# EAGLE schematic schematic_for_box_v13 (EAGLE 9.7.0)
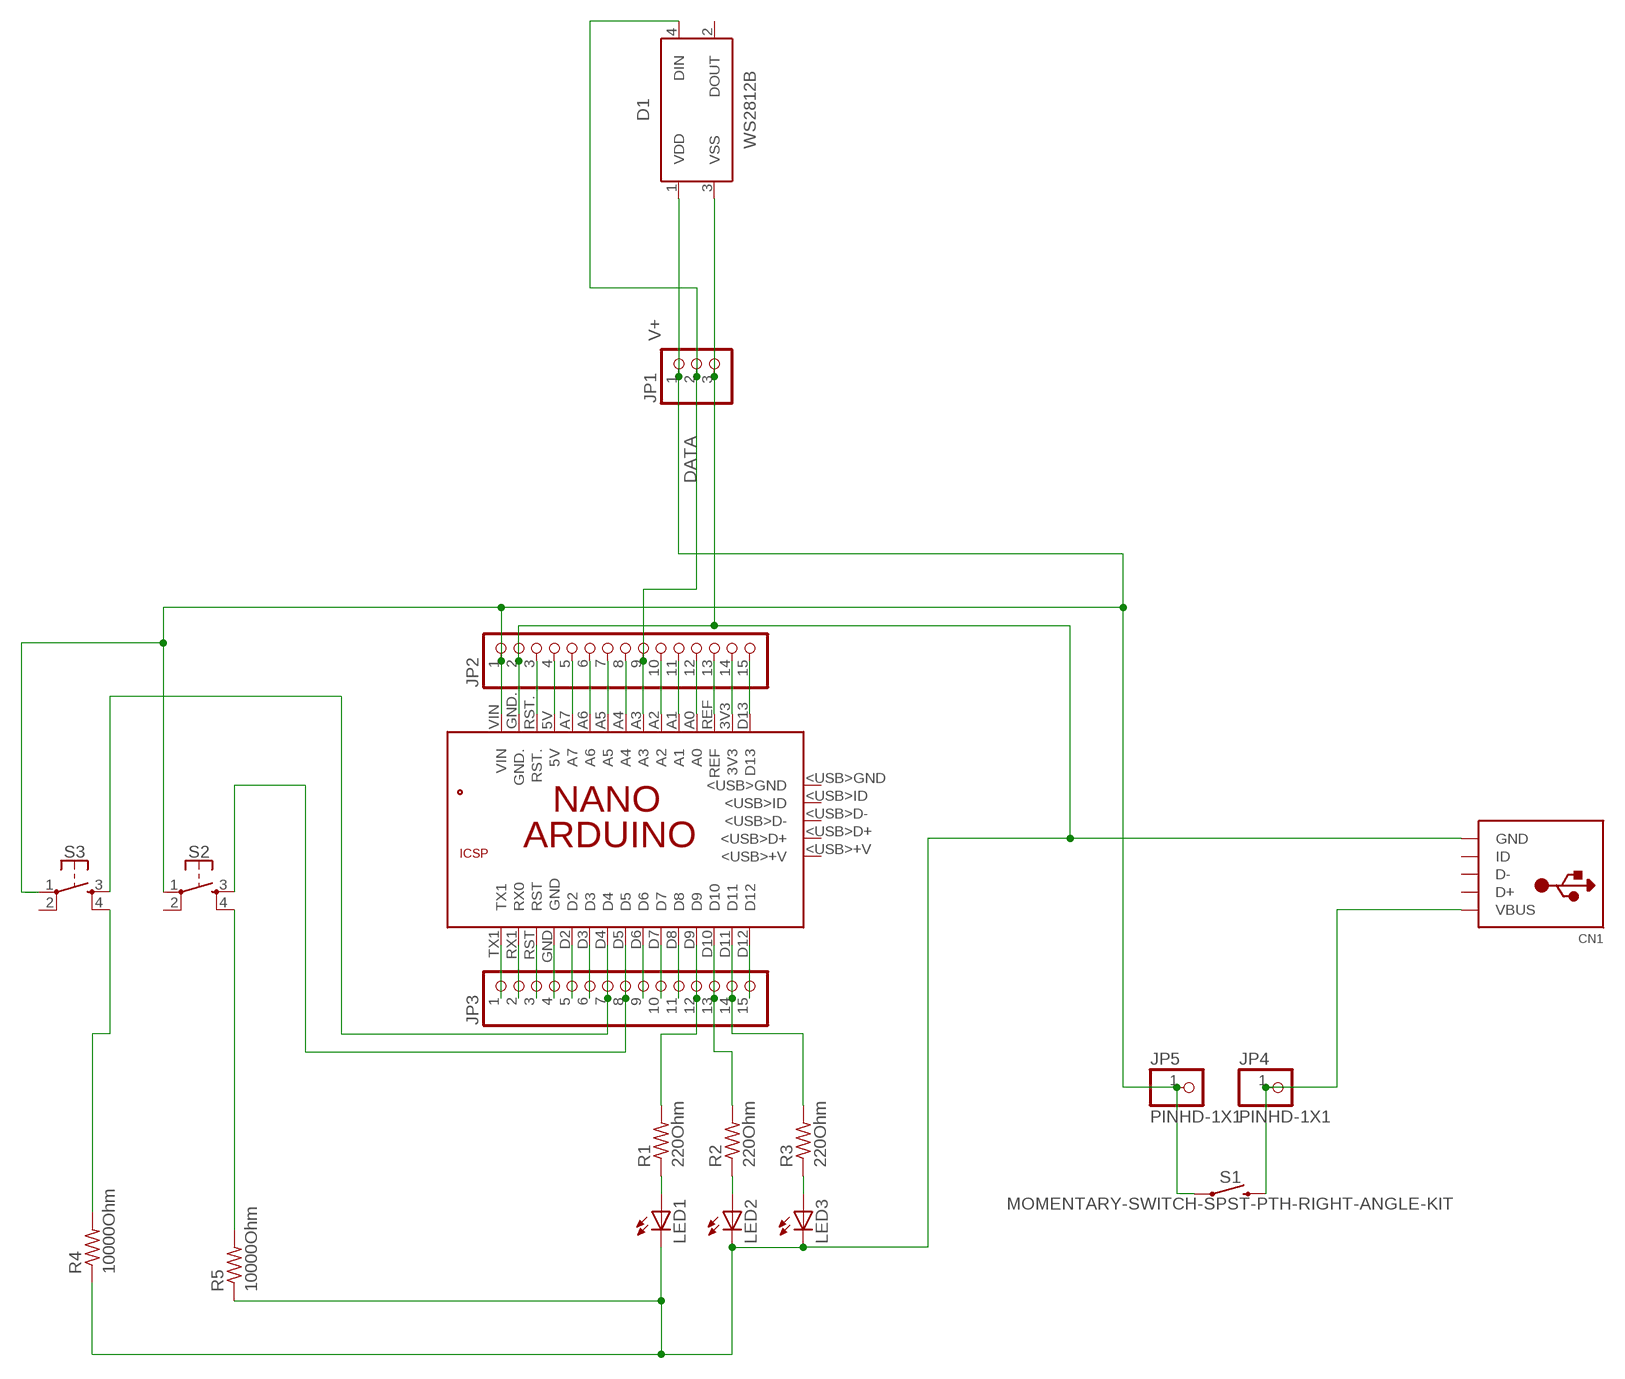
[diagram p0: schematic, sheet 1]

## Parts
CN1  USBMINIB  [USB-MINIB]
D1  WS2812B  [WS2812B]
JP1  PINHD-1X3  [1X03]
JP2  PINHD-1X15  [1X15]
JP3  PINHD-1X15  [1X15]
JP4  PINHD-1X1  [1X01]
JP5  PINHD-1X1  [1X01]
LED1  LED3MM  [LED3MM]
LED2  LED3MM  [LED3MM]
LED3  LED3MM  [LED3MM]
PCB1  ARDUINO_NANO  [ARDUINO_NANO]
R1  220Ohm  FLIPFLOP-RES  [0805-THM]
R2  220Ohm  FLIPFLOP-RES  [0805-THM]
R3  220Ohm  FLIPFLOP-RES  [0805-THM]
R4  10000Ohm  FLIPFLOP-RES  [0805-THM]
R5  10000Ohm  FLIPFLOP-RES  [0805-THM]
S1  MOMENTARY-SWITCH-SPST-PTH-RIGHT-ANGLE-KIT  [TACTILE_SWITCH_PTH_RIGHT_ANGLE_KIT]
S2  MOMENTARY-SWITCH-SPST-2-SMD-5.2MM  [TACTILE_SWITCH_SMD_5.2MM]
S3  MOMENTARY-SWITCH-SPST-2-SMD-5.2MM  [TACTILE_SWITCH_SMD_5.2MM]

## Nets
DATA: D1.4(DIN) JP1.2 JP2.9 PCB1.A3
GND: CN1.GND D1.3(VSS) JP1.3 JP2.2 LED1.K(C) LED2.K(C) LED3.K(C) PCB1.GND. R4.1 R5.1
N$1: CN1.VBUS JP4.1 S1.2
N$2: JP3.1 PCB1.TX1
N$3: JP2.15 PCB1.D13
N$4: JP2.14 PCB1.3V3
N$5: JP3.8 PCB1.D5 S2.3
N$6: JP2.13 PCB1.REF
N$7: LED1.A R1.1
N$8: JP3.7 PCB1.D4 S3.3
N$9: JP3.2 PCB1.RX1(RX0)
N$10: LED2.A R2.1
N$11: JP3.12 PCB1.D9 R1.2
N$12: LED3.A R3.1
N$13: R4.2 S3.4
N$14: R5.2 S2.4
N$15: JP2.12 PCB1.A0
N$16: JP2.11 PCB1.A1
N$17: JP2.10 PCB1.A2
N$18: JP2.8 PCB1.A4
N$19: JP2.7 PCB1.A5
N$20: JP2.6 PCB1.A6
N$21: JP2.5 PCB1.A7
N$22: JP2.4 PCB1.5V
N$23: JP2.3 PCB1.RST.
N$24: JP3.3 PCB1.RST
N$25: JP3.4 PCB1.GND
N$26: JP3.5 PCB1.D2
N$27: JP3.6 PCB1.D3
N$28: JP3.10 PCB1.D7
N$29: JP3.11 PCB1.D8
N$30: JP3.9 PCB1.D6
N$31: JP3.13 PCB1.D10 R2.2
N$32: JP3.14 PCB1.D11 R3.2
N$36: JP3.15 PCB1.D12
V+: D1.1(VDD) JP1.1 JP2.1 JP5.1 PCB1.VIN S1.1 S2.1 S3.1
Unconnected: CN1.D+ CN1.D- CN1.ID D1.2(DOUT) PCB1.5V. PCB1.<USB>+V PCB1.<USB>D+ PCB1.<USB>D- PCB1.<USB>GND PCB1.<USB>ID PCB1.GND_ PCB1.MISO PCB1.MOSI PCB1.RESET.. PCB1.SCK S2.2 S3.2

## Library data of the parts
CN1 = adafruit:USB: USB Connectors USBMINIB - Surface Mount Female Mini-B USB Connector 4UConnector: 06564 By microbuilder.eu Thru-hole RA Female Mini-B USB Connector 4UConnector: 18732 By ladyada.net
D1 = LED:WS2812B: Intelligent control LED integrated light source Datasheet <http://cdn.sparkfun.com/datasheets/BreakoutBoards/WS2812B.pdf>; CATEGORY: LED; COLOR: RGB; DESCRIPTION: LED integrated light source; MANUFACTURER: Worldsemi; MPN: WS2812B; OPERATING_TEMP: -25 ℃ to +80℃(TJ); PART_STATUS: Active; SUB_CATEGORY: RGB
JP1 = adafruit:PINHD-1X3: PIN HEADER
JP2 JP3 = adafruit:PINHD-1X15: PIN HEADER
JP4 JP5 = Connector:PINHD-1X1: PIN HEADER; CATEGORY: CONNECTOR; SUB-CATEGORY: PIN-HEADER
LED1-LED3 = adafruit:LED: LED OSRAM: - CHIPLED LG R971, LG N971, LY N971, LG Q971, LY Q971, LO R971, LY R971 LH N974, LH R974 LS Q976, LO Q976, LY Q976 LO Q996 - Hyper CHIPLED LW Q18S LB Q993, LB Q99A, LB R99A - SideLED LS A670, LO A670, LY A670, LG A670, LP A670 LB A673, LV A673, LT A673, LW A673 LH A674 LY A675 LS A676, LA A676, LO A676, LY A676, LW A676 LS A679, LY A679, LG A679 - Hyper Micro SIDELED® LS Y876, LA Y876, LO Y876, LY Y876 LT Y87S - SmartLED LW L88C, LW L88S LB L89C, LB L89S, LG L890 LS L89K, LO L89K, LY L89K LS L896, LA L896, LO L896, LY L896 - TOPLED LS T670, LO T670, LY T670, LG T670, LP T670 LSG T670, LSP T670, LSY T670, LOP T670, LYG T670 LG T671, LOG T671, LSG T671 LB T673, LV T673, LT T673, LW T673 LH T674 LS T676, LA T676, LO T676, LY T676, LB T676, LH T676, LSB T676, LW T676 LB T67C, LV T67C, LT T67C, LS T67K, LO T67K, LY T67K, LW E67C LS E67B, LA E67B, LO E67B, LY E67B, LB E67C, LV E67C, LT E67C LW T67C LS T679, LY T679, LG T679 LS T770, LO T770, LY T770, LG T770, LP T770 LB T773, LV T773, LT T773, LW T773 LH T774 LS E675, LA E675, LY E675, LS T675 LS T776, LA T776, LO T776, LY T776, LB T776 LHGB T686 LT T68C, LB T68C - Hyper Mini TOPLED® LB M676 - Mini TOPLED Santana® LG M470 LS M47K, LO M47K, LY M47K Source: http://www.osram.convergy.de/
PCB1 = E14_Arduino_revC:ARDUINO_NANO: Device for representing an Arduino Nano board with a footprint in an EAGLE design. Created by Dave Young for Element14. More EAGLE documentation at: http://www.element14.com/community/community/knode/cadsoft_eagle
R1-R5 = adafruit:FLIPFLOP-RES: Flip Flop resistor An 0805 resistor inside a standard 1/4W 5% resistor. Makes for easy mods
S1 = SparkFun-Switches:MOMENTARY-SWITCH-SPST: Momentary Switch (Pushbutton) - SPST Normally-open (NO) SPST momentary switches (buttons, pushbuttons). Variants PTH-12MM - 12mm square, through-hole Momentary Pushbutton Switch - 12mm Square <https://www.sparkfun.com/products/9190> (COM-09190) PTH-6.0MM, PTH-6.0MM-KIT - 6.0mm square, through-hole Mini Pushbutton Switch <https://www.sparkfun.com/products/97> (COM-00097) KIT package intended for soldering kit's - only one side of pads' copper is exposed. PTH-RIGHT-ANGLE-KIT - Right-angle, through-hole Right Angle Tactile Button <https://www.sparkfun.com/products/10791> - Used on SparkFun BigTime Watch Kit <https://www.sparkfun.com/products/11734> SMD-12MM - 12mm square, surface-mount Tactile Button - SMD (12mm) <https://www.sparkfun.com/products/12993> (COM-12993) Used on SparkFun PicoBoard <https://www.sparkfun.com/products/11888> SMD-4.5MM - 4.5mm Square Trackball Switch Used on SparkFun Blackberry Trackballer Breakout <https://www.sparkfun.com/products/13169> SMD-4.6MMX2.8MM - 4.60mm x 2.80mm, surface mount Used on SparkFun SAMD21 Mini Breakout <https://www.sparkfun.com/products/13664> SMD-5.2MM, SMD-5.2-REDUNDANT - 5.2mm square, surface-mount Mini Pushbutton Switch - SMD <https://www.sparkfun.com/products/8720> (COM-08720) Used on Arduino Pro Mini <https://www.sparkfun.com/products/11114> REDUNDANT package connects both switch circuits together SMD-6.0X3.5MM - 6.0 x 3.5mm, surface mount Momentary Reset Switch SMD <https://www.sparkfun.com/products/8229> (COM-08229) SMD-6.2MM-TALL - 6.2mm square, surface mount Tactile Button - SMD (6mm) <https://www.sparkfun.com/products/12992> Used on SparkFun Digital Sandbox <https://www.sparkfun.com/products/12651> SMD-RIGHT-ANGLE - Right-angle, surface mount Used on SparkFun Block for Intel® Edison - Arduino <https://www.sparkfun.com/products/13036>; PROD_ID: CONN-10672; SF_SKU: COM-10791
S2 S3 = SparkFun-Switches:MOMENTARY-SWITCH-SPST-2: Momentary Switch (Pushbutton) - SPST - Two Circuits Normally-open (NO) SPST momentary switches (buttons, pushbuttons). Schematic symbol includes two switch circuits. Variants SMD-4.6MMX2.8MM - 4.60mm x 2.80mm Tactile Momentary Button Switch - Used on SparkFun SAMD21 Mini Breakout <https://www.sparkfun.com/products/13664> SMD-5.2MM - Mini Pushbutton Switch - SMD <https://www.sparkfun.com/products/8720> - Used on Arduino Pro Mini <https://www.sparkfun.com/products/11114>; PROD_ID: SWCH-08247; SF_SKU: COM-08720